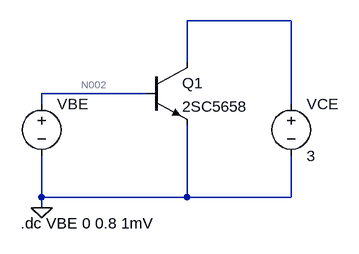
[diagram p0: schematic Draft1.asc]
Draft1.asc, the LTspice schematic file:
Version 4.1
SHEET 1 880 680
WIRE 336 64 176 64
WIRE 176 128 176 64
WIRE 112 176 -48 176
WIRE -48 192 -48 176
WIRE 336 192 336 64
WIRE -48 336 -48 272
WIRE 176 336 176 224
WIRE 176 336 -48 336
WIRE 336 336 336 272
WIRE 336 336 176 336
WIRE -48 352 -48 336
FLAG -48 352 0
SYMBOL npn 112 128 R0
SYMATTR InstName Q1
SYMATTR Value 2SC5658
SYMBOL voltage -48 176 R0
SYMATTR InstName VBE
SYMATTR Value ""
SYMBOL voltage 336 176 R0
WINDOW 123 0 0 Left 0
WINDOW 39 0 0 Left 0
SYMATTR InstName VCE
SYMATTR Value 3
TEXT -80 376 Left 2 !.dc VBE 0 0.8 1mV

The netlist it stands for:
* Draft1.asc
Q1 N001 N002 0 0 2SC5658
VBE N002 0
VCE N001 0 3
.model NPN NPN
.model PNP PNP
.lib standard.bjt
.dc VBE 0 0.8 1mV
.backanno
.end

* Results of the author's LTspice run, read from the files saved beside the schematic
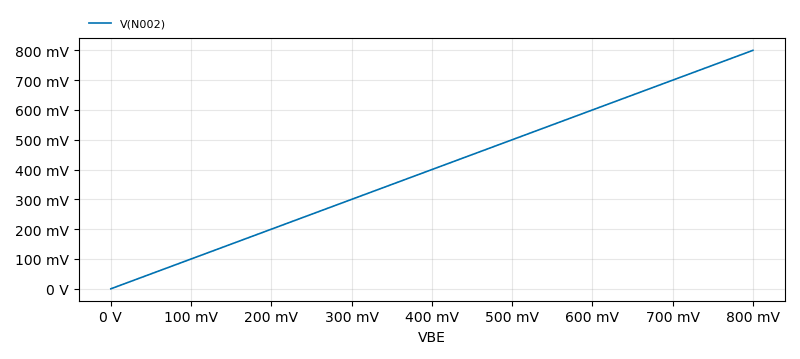
[diagram p1: DC transfer characteristic of Draft1.asc, plotted from the saved traces]
* DC transfer characteristic, 1 run:
*   V(N002): 0 V at VBE=0 V, 800 mV at VBE=800 mV, min 0 V, max 800 mV